# EAGLE board PCB (EAGLE 9.2.0)
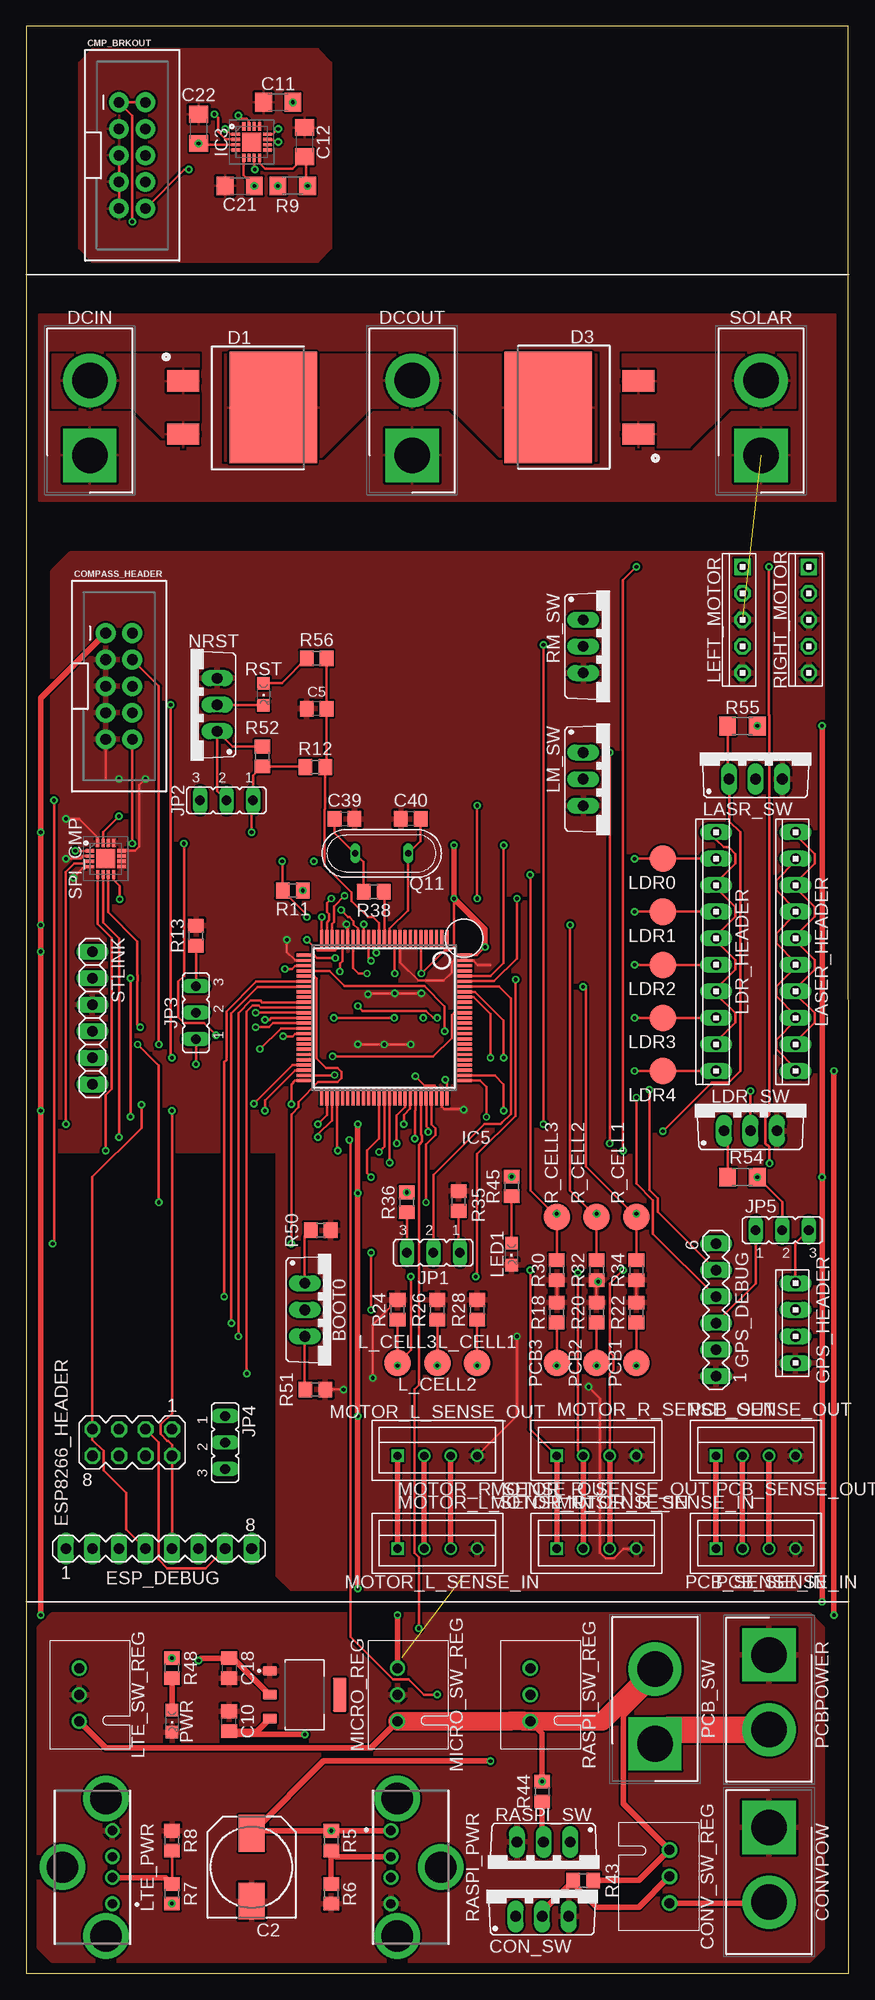
[diagram p5: board, top side]
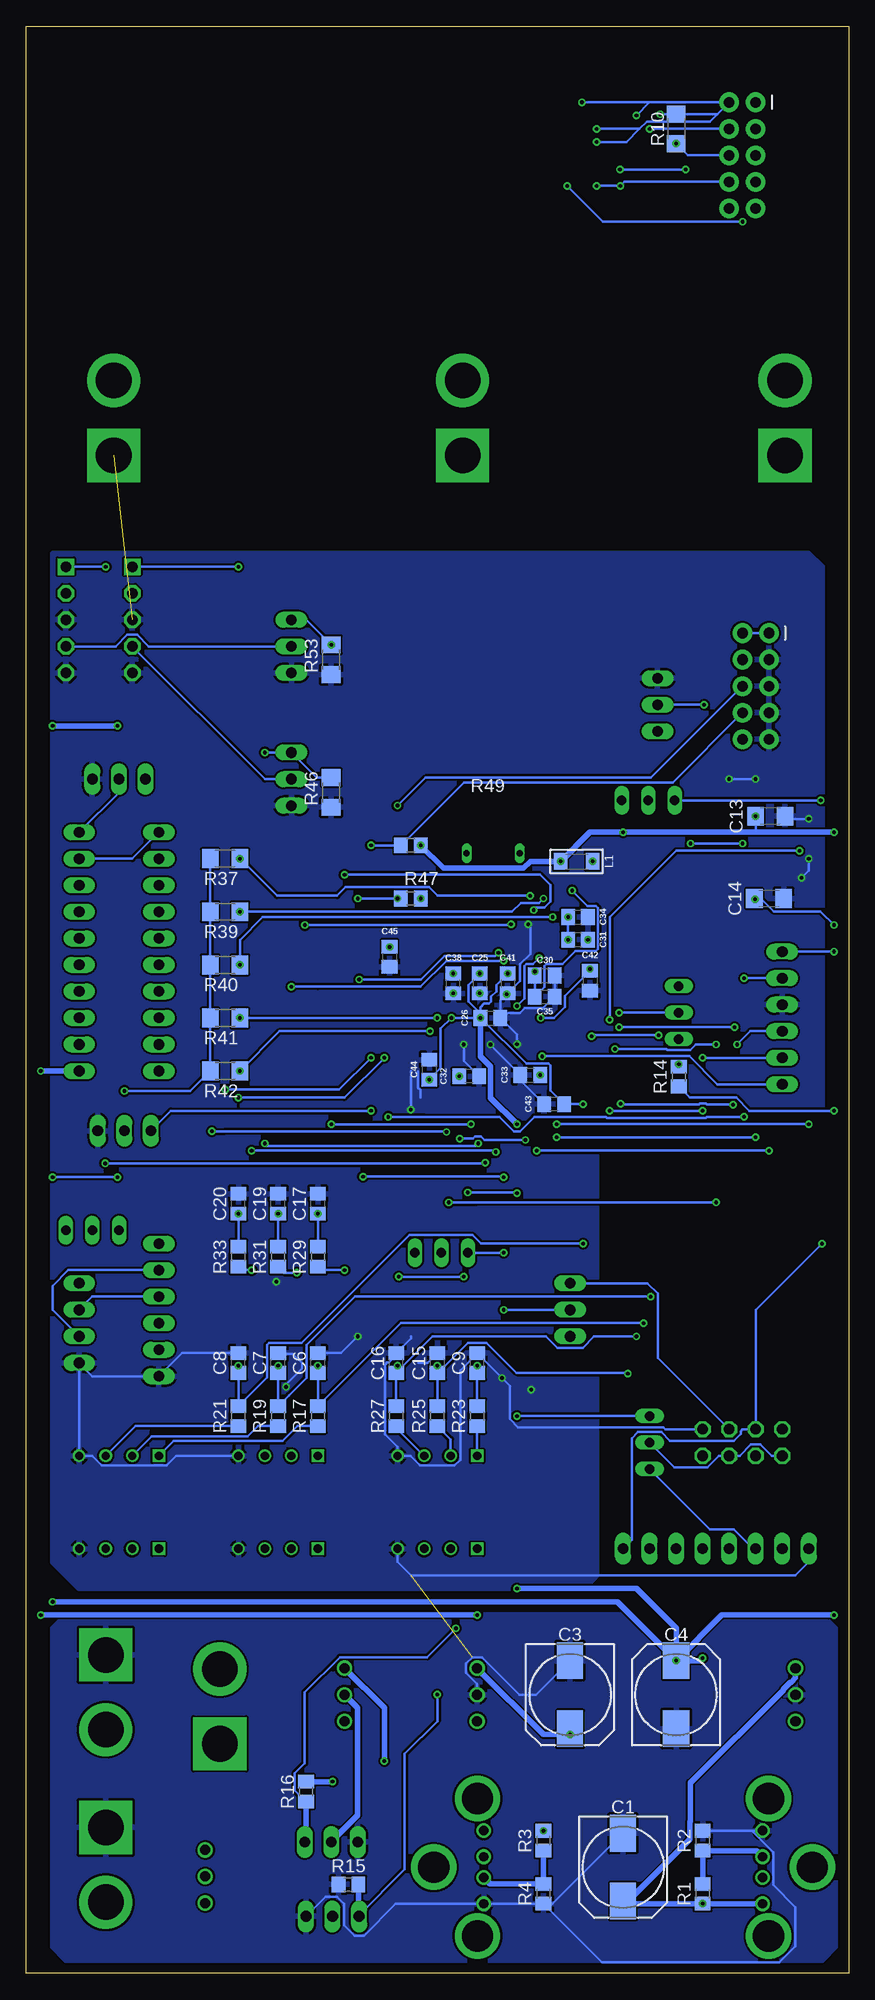
[diagram p6: board, bottom side, seen from below]

Size 78.74 x 186.36 mm. Coordinates in mm from the lower left corner, seen from the top.
Outline: 0,0 78.74,0 78.72,186.36 0,186.36 0,0
Copper layers (1*16): Top 0.0356mm / dielectric 1.5011mm / Bottom 0.0356mm
Design rules "ECE_Senior_Design *": minimum track width 8mil, minimum drill 13mil, track to track 8mil, track to pad 8mil, pad to pad 6mil, via to via 8mil, smd to smd 6mil, copper to edge 15mil, drill to drill 8mil, minimum pad ring 7mil, minimum via ring 7mil, stop-mask expansion 3mil, vias tented up to drill 0mil, thermal gap 10mil
Net classes: 0 default: width 0.254 mm

## Footprints (pad centres in the part's own frame; a part is rotated, then mirrored left to right if it is on the bottom)
TO220BV = drill 1.016 long: D 0,-2.54; G -2.54,-2.54; S 2.54,-2.54
140CLH-0810 = smd 3.5 x 2.5: + 3.25,0; - -3.25,0
C0805 = smd 1.3 x 1.5: 1 -0.95,0; 2 0.95,0
C1206 = smd 1.6 x 1.8: 1 -1.4,0; 2 1.4,0
2X5-SHROUDED = drill 1.016 pad 1.88: 1 -1.27,5.08; 2 1.27,5.08; 3 -1.27,2.54; 4 1.27,2.54; 5 -1.27,0; 6 1.27,0; 7 -1.27,-2.54; 8 1.27,-2.54; 9 -1.27,-5.08; 10 1.27,-5.08
OKI-78SR = drill 0.96 pad 1.46: 1 0,0; 2 2.54,0; 3 5.08,0
SHDR2W320P716_1X2_1574X813X158 = drill 3.4 pad 5.1 square: 1 0,0 | drill 3.4 pad 5.1: 2 7.163,0
TO-263AC(SMPD) = smd 2.03 x 3.05: 1 -2.54,-2.734; 2 2.54,-2.734 | smd 10.66 x 8.38: 3 0,5.881
MA04-2 = drill 1.016 octagon: 1 -3.81,-1.27; 2 -3.81,1.27; 3 -1.27,-1.27; 4 -1.27,1.27; 5 1.27,-1.27; 6 1.27,1.27; 7 3.81,-1.27; 8 3.81,1.27
MA08-1 = drill 1.016 long: 1 -8.89,0; 2 -6.35,0; 3 -3.81,0; 4 -1.27,0; 5 1.27,0; 6 3.81,0; 7 6.35,0; 8 8.89,0
MA06-1 = drill 1.016 long: 1 -6.35,0; 2 -3.81,0; 3 -1.27,0; 4 1.27,0; 5 3.81,0; 6 6.35,0
10X04MTA = drill 1.016 long: 1 3.81,0; 2 1.27,0; 3 -1.27,0; 4 -3.81,0
QFN50P300X300X100-17N = smd 0.8 x 0.3: 1 -1.5,0.75; 2 -1.5,0.25; 3 -1.5,-0.25; 4 -1.5,-0.75; 9 1.5,-0.75; 10 1.5,-0.25; 11 1.5,0.25; 12 1.5,0.75 | smd 0.3 x 0.8: 5 -0.75,-1.5; 6 -0.25,-1.5; 7 0.25,-1.5; 8 0.75,-1.5; 13 0.75,1.5; 14 0.25,1.5; 15 -0.25,1.5; 16 -0.75,1.5 | smd 1.8 x 1.8: 17 0,0
QFP50P1600X1600X160-100N = smd 0.3 x 1.6: 1 -6,-7.6; 2 -5.5,-7.6; 3 -5,-7.6; 4 -4.5,-7.6; 5 -4,-7.6; 6 -3.5,-7.6; 7 -3,-7.6; 8 -2.5,-7.6; 9 -2,-7.6; 10 -1.5,-7.6; 11 -1,-7.6; 12 -0.5,-7.6; 13 0,-7.6; 14 0.5,-7.6; 15 1,-7.6; 16 1.5,-7.6; 17 2,-7.6; 18 2.5,-7.6; 19 3,-7.6; 20 3.5,-7.6; 21 4,-7.6; 22 4.5,-7.6; 23 5,-7.6; 24 5.5,-7.6; 25 6,-7.6; 51 6,7.6; 52 5.5,7.6; 53 5,7.6; 54 4.5,7.6; 55 4,7.6; 56 3.5,7.6; 57 3,7.6; 58 2.5,7.6; 59 2,7.6; 60 1.5,7.6; 61 1,7.6; 62 0.5,7.6; 63 0,7.6; 64 -0.5,7.6; 65 -1,7.6; 66 -1.5,7.6; 67 -2,7.6; 68 -2.5,7.6; 69 -3,7.6; 70 -3.5,7.6; 71 -4,7.6; 72 -4.5,7.6; 73 -5,7.6; 74 -5.5,7.6; 75 -6,7.6 | smd 1.6 x 0.3: 26 7.6,-6; 27 7.6,-5.5; 28 7.6,-5; 29 7.6,-4.5; 30 7.6,-4; 31 7.6,-3.5; 32 7.6,-3; 33 7.6,-2.5; 34 7.6,-2; 35 7.6,-1.5; 36 7.6,-1; 37 7.6,-0.5; 38 7.6,0; 39 7.6,0.5; 40 7.6,1; 41 7.6,1.5; 42 7.6,2; 43 7.6,2.5; 44 7.6,3; 45 7.6,3.5; 46 7.6,4; 47 7.6,4.5; 48 7.6,5; 49 7.6,5.5; 50 7.6,6; 76 -7.6,6; 77 -7.6,5.5; 78 -7.6,5; 79 -7.6,4.5; 80 -7.6,4; 81 -7.6,3.5; 82 -7.6,3; 83 -7.6,2.5; 84 -7.6,2; 85 -7.6,1.5; 86 -7.6,1; 87 -7.6,0.5; 88 -7.6,0; 89 -7.6,-0.5; 90 -7.6,-1; 91 -7.6,-1.5; 92 -7.6,-2; 93 -7.6,-2.5; 94 -7.6,-3; 95 -7.6,-3.5; 96 -7.6,-4; 97 -7.6,-4.5; 98 -7.6,-5; 99 -7.6,-5.5; 100 -7.6,-6
JP2 = drill 0.914 long: 1 -2.54,0; 2 0,0; 3 2.54,0
L1206 = smd 1.3 x 1.6: 1 -1.524,0; 2 1.524,0
B2,54 = smd 2.54 x 2.54: TP 0,0
10X10MTA = drill 1.016 long: 1 11.43,0; 2 8.89,0; 3 6.35,0; 4 3.81,0; 5 1.27,0; 6 -1.27,0; 7 -3.81,0; 8 -6.35,0; 9 -8.89,0; 10 -11.43,0
CHIPLED_0805 = smd 1.2 x 1.2: A 0,-1.05; C 0,1.05
1X05MTA = drill 1.016 pad 1.575 square: 1 5.08,0 | drill 1.016 pad 1.575 octagon: 2 2.54,0; 3 0,0; 4 -2.54,0; 5 -5.08,0
105057-0001 = drill 0.9 pad 1.4: 1 -3.5,-1.9; 2 -1,-1.9; 3 1,-1.9; 4 3.5,-1.9 | drill 3 pad 4.35: 5 6.57,-1.3; 6 0,2.88; 7 -6.57,-1.3
SOT229P700X180-4N = smd 0.93 x 1.31: 1 -2.29,-3.345; 2 0,-3.345; 3 2.29,-3.345 | smd 3.24 x 1.31: 4 0,3.345
B4B-XH = drill 0.8 square: P$1 -3.81,0 | drill 0.8: P$2 -1.27,0; P$3 1.27,0; P$4 3.81,0
QS = drill 0.61 long: 1 -2.54,0; 2 2.54,0
R0805 = smd 1.3 x 1.5: 1 -0.95,0; 2 0.95,0
R1206 = smd 1.6 x 1.803: 1 -1.422,0; 2 1.422,0
1X06 = drill 1.016 long: 1 -6.35,0; 2 -3.81,0; 3 -1.27,0; 4 1.27,0; 5 3.81,0; 6 6.35,0

## Placement (x,y rotation side)
BOOT0  IRF512  [TO220BV]  29.21,63.5 270 top
C1  100uF  [140CLH-0810]  21.59,10.16 270 bottom
C2  100uF  [140CLH-0810]  21.59,10.16 90 top
C3  100uF  [140CLH-0810]  26.67,26.67 270 bottom
C4  100uF  [140CLH-0810]  16.51,26.67 90 bottom
C5  100nF  [C0805]  27.81,121.03 180 top
C6  22nF  [C0805]  50.8,58.42 90 bottom
C7  22nF  [C0805]  54.61,58.42 90 bottom
C8  22nF  [C0805]  58.42,58.42 90 bottom
C9  22nF  [C0805]  35.56,58.42 90 bottom
C10  10uF  [C0805]  19.43,24.13 90 top
C11  10uF  [C1206]  24.13,179.07 180 top
C12  10uF  [C1206]  26.67,175.26 90 top
C13  0.1uF  [C1206]  7.49,110.74 180 bottom
C14  0.1uF  [C1206]  7.62,102.87 0 bottom
C15  22nF  [C0805]  39.37,58.42 90 bottom
C16  22nF  [C0805]  43.31,58.42 90 bottom
C17  22nF  [C0805]  50.8,73.66 90 bottom
C18  22uF  [C0805]  19.43,29.21 270 top
C19  22nF  [C0805]  54.61,73.66 90 bottom
C20  22nF  [C0805]  58.42,73.66 90 bottom
C21  10pF  [C1206]  20.45,171.07 0 top
C22  10pF  [C1206]  16.51,176.53 270 top
C25  100nF  [C0805]  35.31,94.74 270 bottom
C26  10uF  [C0805]  34.29,91.44 0 bottom
C30  100nF  [C0805]  29.08,95.5 0 bottom
C31  100nF  [C0805]  25.91,98.93 0 bottom
C32  2.2uF  [C0805]  36.32,85.85 180 bottom
C33  2.2uF  [C0805]  30.48,85.98 0 bottom
C34  1uF  [C0805]  25.91,101.09 0 bottom
C35  1uF  [C0805]  29.08,93.47 0 bottom
C38  100nF  [C0805]  37.85,94.74 90 bottom
C39  20pF  [C0805]  30.48,110.49 0 top
C40  20pF  [C0805]  36.83,110.49 180 top
C41  100nF  [C0805]  32.64,94.74 270 bottom
C42  100nF  [C0805]  24.77,95 270 bottom
C43  100nF  [C0805]  28.19,83.19 180 bottom
C44  100nF  [C0805]  40.13,86.49 90 bottom
C45  100nF  [C0805]  43.94,97.28 270 bottom
CMP_BRKOUT  [2X5-SHROUDED]  10.16,173.99 0 top
COMPASS_HEADER  [2X5-SHROUDED]  8.89,123.19 0 top
CON_SW  IRF512  [TO220BV]  49.4,8 0 top
CONV_SW_REG  OKI-78SR-5_1.5-W36-C  [OKI-78SR]  61.59,11.81 270 top
CONVPOW  [SHDR2W320P716_1X2_1574X813X158]  71.12,13.97 270 top
D1  V60D45C-M3_I  [TO-263AC(SMPD)]  17.78,149.86 270 top
D3  V60D45C-M3_I  [TO-263AC(SMPD)]  55.88,149.86 90 top
DCIN  [SHDR2W320P716_1X2_1574X813X158]  6.1,145.29 90 top
DCOUT  [SHDR2W320P716_1X2_1574X813X158]  36.96,145.29 90 top
ESP8266_HEADER  [MA04-2]  10.16,50.8 180 top
ESP_DEBUG  [MA08-1]  12.7,40.64 0 top
GPS_DEBUG  [MA06-1]  66.04,63.5 90 top
GPS_HEADER  [10X04MTA]  73.66,62.23 90 top
IC3  MLX90393ELW-ABA-011-SP  [QFN50P300X300X100-17N]  21.59,175.26 0 top
IC5  STM32F407VGT6  [QFP50P1600X1600X160-100N]  34.29,91.44 180 top
JP1  [JP2]  38.99,68.96 180 top
JP2  [JP2]  19.18,112.27 180 top
JP3  [JP2]  16.26,91.95 90 top
JP4  [JP2]  19.05,50.8 270 top
JP5  [JP2]  72.39,71.12 0 top
L1  FB_1206  [L1206]  26.04,106.43 180 bottom
L_CELL1  TPSQB2,54  [B2,54]  43.18,58.42 0 top
L_CELL2  TPSQB2,54  [B2,54]  39.37,58.42 0 top
L_CELL3  PCB_CELL3  [B2,54]  35.56,58.42 0 top
LASER_HEADER  [10X10MTA]  73.66,97.79 90 top
LASR_SW  IRF512  [TO220BV]  69.85,116.84 0 top
LDR0  TPSQB2,54  [B2,54]  60.96,106.68 180 top
LDR1  TPSQB2,54  [B2,54]  60.96,101.6 180 top
LDR2  TPSQB2,54  [B2,54]  60.96,96.52 180 top
LDR3  TPSQB2,54  [B2,54]  60.96,91.44 180 top
LDR4  TPSQB2,54  [B2,54]  60.96,86.36 180 top
LDR_HEADER  [10X10MTA]  66.04,97.79 90 top
LDR_SW  IRF512  [TO220BV]  69.34,83.19 0 top
LED1  BLUE  [CHIPLED_0805]  46.48,68.83 180 top
LEFT_MOTOR  [1X05MTA]  68.58,129.54 90 top
LM_SW  IRF512  [TO220BV]  55.88,114.3 270 top
LTE_PWR  LTE Modem Power Supply  [105057-0001]  6.35,10.16 90 top
LTE_SW_REG  OKI-78SR-5_1.5-W36-C  [OKI-78SR]  5.08,24.13 90 top
MICRO_REG  AMS1117-3.3  [SOT229P700X180-4N]  26.67,26.67 270 top
MICRO_SW_REG  OKI-78SR-5_1.5-W36-C  [OKI-78SR]  35.56,24.13 90 top
MOTOR_L_SENSE_IN  MOTOR_L_SENSE_IN  [B4B-XH]  39.37,40.64 0 top
MOTOR_L_SENSE_OUT  MOTOR_R_SENSE_OUT  [B4B-XH]  39.37,49.53 0 top
MOTOR_R_SENSE_IN  MOTOR_R_SENSE_IN  [B4B-XH]  54.61,40.64 0 top
MOTOR_R_SENSE_OUT  MOTOR_R_SENSE_OUT  [B4B-XH]  54.61,49.53 0 top
NRST  IRF512  [TO220BV]  15.75,121.41 90 top
PCB1  TPSQB2,54  [B2,54]  58.42,58.42 0 top
PCB2  TPSQB2,54  [B2,54]  54.61,58.42 0 top
PCB3  PCB_CELL3  [B2,54]  50.8,58.42 0 top
PCB_SENSE_IN  PCB_SENSE_IN  [B4B-XH]  69.85,40.64 0 top
PCB_SENSE_OUT  PCB_SENSE_OUT  [B4B-XH]  69.85,49.53 0 top
PCB_SW  [SHDR2W320P716_1X2_1574X813X158]  60.2,21.97 90 top
PCBPOWER  [SHDR2W320P716_1X2_1574X813X158]  71.12,30.48 270 top
PWR  RED  [CHIPLED_0805]  13.97,24.13 180 top
Q11  8Mhz  [QS]  34.04,107.19 180 top
R1  43k  [R0805]  13.97,7.62 90 bottom
R2  51k  [R0805]  13.97,12.7 90 bottom
R3  43K  [R0805]  29.21,12.7 270 bottom
R4  51K  [R0805]  29.21,7.62 270 bottom
R5  75K  [R0805]  29.21,12.7 270 top
R6  51K  [R0805]  29.21,7.62 270 top
R7  75k  [R0805]  13.97,7.62 90 top
R8  51k  [R0805]  13.97,12.7 90 top
R9  10K  [R1206]  25.53,171.07 180 top
R10  10K  [R1206]  16.51,176.53 270 bottom
R11  47  [R0805]  25.53,103.63 180 top
R12  100K  [R0805]  27.69,115.44 0 top
R13  510  [R0805]  16.26,99.31 270 top
R14  10K  [R0805]  16.26,85.83 90 bottom
R15  100k  [R0805]  47.88,8.51 0 bottom
R16  10k  [R0805]  51.94,17.4 270 bottom
R17  18k  [R0805]  50.8,53.34 90 bottom
R18  6.2k  [R0805]  50.8,63.25 90 top
R19  8.2k  [R0805]  54.61,53.34 90 bottom
R20  5.1k  [R0805]  54.61,63.25 90 top
R21  680  [R0805]  58.42,53.34 90 bottom
R22  2.4k  [R0805]  58.42,63.25 90 top
R23  18k  [R0805]  35.56,53.34 90 bottom
R24  6.2k  [R0805]  35.56,63.5 90 top
R25  8.2k  [R0805]  39.37,53.34 90 bottom
R26  5.1k  [R0805]  39.37,63.5 90 top
R27  680  [R0805]  43.31,53.34 90 bottom
R28  2.4k  [R0805]  43.18,63.5 90 top
R29  18k  [R0805]  50.8,68.58 90 bottom
R30  6.2k  [R0805]  50.8,67.31 270 top
R31  8.2k  [R0805]  54.61,68.58 90 bottom
R32  5.1k  [R0805]  54.61,67.31 270 top
R33  680  [R0805]  58.42,68.58 90 bottom
R34  2.4k  [R0805]  58.42,67.31 270 top
R35  510  [R0805]  41.4,73.91 270 top
R36  10K  [R0805]  36.45,73.79 90 top
R37  100k  [R1206]  59.69,106.68 180 bottom
R38  220  [R0805]  33.27,103.5 180 top
R39  100k  [R1206]  59.69,101.6 180 bottom
R40  100k  [R1206]  59.69,96.52 180 bottom
R41  100k  [R1206]  59.69,91.44 180 bottom
R42  100k  [R1206]  59.69,86.36 180 bottom
R43  1M  [R0805]  53.34,8.89 180 top
R44  1M  [R0805]  49.4,17.4 270 top
R45  200  [R0805]  46.48,75.31 270 top
R46  100k  [R1206]  49.53,113.03 90 bottom
R47  10K  [R0805]  41.91,102.87 0 bottom
R48  200  [R0805]  13.97,29.21 270 top
R49  10K  [R0805]  41.91,107.95 0 bottom
R50  100K  [R0805]  28.19,71.12 180 top
R51  510  [R0805]  27.69,55.88 0 top
R52  100K  [R0805]  22.61,116.46 90 top
R53  100k  [R1206]  49.53,125.73 90 bottom
R54  100k  [R1206]  68.58,76.2 0 top
R55  100k  [R1206]  68.58,119.38 0 top
R56  200  [R0805]  27.81,125.86 0 top
R_CELL1  TPSQB2,54  [B2,54]  58.42,72.39 0 top
R_CELL2  TPSQB2,54  [B2,54]  54.61,72.39 0 top
R_CELL3  PCB_CELL3  [B2,54]  50.8,72.39 0 top
RASPI_PWR  Raspi Power Supply  [105057-0001]  36.83,10.16 270 top
RASPI_SW  IRF512  [TO220BV]  49.53,10.03 180 top
RASPI_SW_REG  OKI-78SR-5_1.5-W36-C  [OKI-78SR]  48.26,24.13 90 top
RIGHT_MOTOR  [1X05MTA]  74.93,129.54 90 top
RM_SW  IRF512  [TO220BV]  55.88,127 270 top
RST  RED  [CHIPLED_0805]  22.73,122.43 180 top
SOLAR  [SHDR2W320P716_1X2_1574X813X158]  70.36,145.29 90 top
SPI_CMP  MLX90393ELW-ABA-011-SP  [QFN50P300X300X100-17N]  7.62,106.68 0 top
STLINK  [1X06]  6.35,91.44 270 top

## Tracks (layer width: path | path; a pad name or v marks a point on that pad's centre or on a via)
C_MOS  (via drill 0.35)
  Top 0.254: v30.94,79.76 31.07,79.63 31.07,32.2 35.12,28.15 36.62,28.15 38.1,26.67 v39.37,26.67 | IC5.69 37.27,83.82 37.27,82.61 37.21,82.55 v37.21,79.88
  Bottom 0.254: v37.21,79.88 35.98,79.88 35.76,80.11 35.19,80.11 34.84,79.76 v30.94,79.76 | v39.37,26.67 39.37,24.13 42.5,21 42.5,9.96 46.93,5.53
  Bottom 0.508: R15.2 46.93,5.53 CON_SW.G
CMP_INT  (via drill 0.35)
  Top 0.254: v12.7,88.9 12.7,123.19 COMPASS_HEADER.4 | v22.38,88.47 22.42,88.47 24.39,90.44 IC5.40
  Bottom 0.254: v22.38,88.47 17.44,88.47 17.36,88.39 15.15,88.39 14.64,88.9 v12.7,88.9
CMP_MISO  (via drill 0.35)
  Top 0.254: SPI_CMP.6 7.37,100.58 8.89,99.06 v8.89,80.01 | IC5.53 29.27,83.82 29.27,81.64 27.94,80.31 v27.94,80.01
  Bottom 0.254: v27.94,80.01 v8.89,80.01
CMP_MOSI  (via drill 0.35)
  Top 0.254: IC5.54 29.79,78.8 v29.84,78.74 | v7.62,78.74 7.62,84.05 8.2,84.64 8.2,99.1 6.87,100.43 SPI_CMP.5
  Bottom 0.254: v29.84,78.74 v7.62,78.74
CMP_SCL  (via drill 0.35)
  Top 0.254: IC5.95 41.91,94.96 44.81,94.96 46.99,97.14 v46.99,102.87 | v43.18,111.76 v43.18,102.87
  Bottom 0.254: COMPASS_HEADER.6 18.92,114.43 35.56,114.43 40.51,114.43 v43.18,111.76 | R47.1 v43.18,102.87 v46.99,102.87
CMP_SCLK  (via drill 0.35)
  Top 0.254: IC5.52 28.79,82.13 v27.94,81.28 | SPI_CMP.3 5.6,106.43 5.4,106.22 4.62,106.22 3.81,105.41 v3.81,81.28
  Bottom 0.254: v3.81,81.28 v27.94,81.28
CMP_SDA  (via drill 0.35)
  Top 0.254: IC5.96 44.45,95.44 45.72,96.71 v45.72,107.95
  Bottom 0.254: v45.72,107.95 R49.1 36.84,113.97 16.84,113.97 COMPASS_HEADER.8
CMP_SPI_INT  (via drill 0.35)
  Top 0.254: SPI_CMP.1 4.71,107.43 v4.7,107.44 | IC5.38 26.67,91.42 23.46,91.42 23.3,91.26 v22.86,91.26
  Bottom 0.254: v4.7,107.44 16.51,107.44 22.85,101.1 v22.85,91.27 v22.86,91.26
CMP_TRG  (via drill 0.35)
  Top 0.254: v24.6,89.69 25.52,89.69 25.75,89.92 26.67,89.92 IC5.41 | v10.16,108.12 COMPASS_HEADER.10 | v18.18,89.79 17.04,90.93 15.15,90.93 14.55,91.53 14.55,94.91 15.11,95.47 v15.11,108.12
  Bottom 0.254: v15.11,108.12 v10.16,108.12 | v18.18,89.79 24.5,89.79 v24.6,89.69
CMP_TRIG  (via drill 0.35)
  Top 0.254: SPI_CMP.7 7.87,101.55 10.65,98.77 10.65,95.56 10.68,95.53 10.68,94.97 10.65,94.94 10.65,90.82 v10.92,90.55 | v21.97,90.55 23.24,90.55 23.63,90.94 IC5.39
  Bottom 0.254: v21.97,90.55 v10.92,90.55
ESP_GPIO0  (via drill 0.35)
  Top 0.254: v2.67,112.27 2.67,69.98 v2.54,69.85
  Bottom 0.254: v2.67,112.27 JP2.3 | ESP_DEBUG.8 20.75,41.48 20.75,51.22 20.16,51.82 17.94,51.82 17.11,50.98 10.98,50.98 10.34,51.62 10.34,51.89 10.16,52.07 ESP8266_HEADER.5 8.89,63.5 v2.54,69.85
ESP_GPIO2
  Top 0.254: ESP8266_HEADER.3 12.7,50.8 12.7,39.6 13.52,38.79 17.2,38.79 ESP_DEBUG.7 | BOOT0.G 26.67,70.55 R50.2
  Bottom 0.254: ESP8266_HEADER.3 18.27,58.91 18.27,65.05 19.26,66.04 BOOT0.G
ESP_RX  (via drill 0.35)
  Top 0.254: ESP_DEBUG.4 9.57,42.5 9.57,46 7.44,48.13 7.44,49.98 6.35,51.08 ESP8266_HEADER.7 6.35,76.2 11.05,80.9 v11.05,83.14 | IC5.47 26.67,86.92 25.5,86.92 v21.81,83.23
  Bottom 0.254: v21.81,83.23 21.71,83.14 14.35,83.14 14.25,83.23 13.69,83.23 13.59,83.14 v11.05,83.14
ESP_TX  (via drill 0.35)
  Top 0.254: ESP_DEBUG.5 ESP8266_HEADER.2 13.97,50.6 13.59,50.98 13.52,50.98 12.88,51.62 12.88,52.52 13.97,53.62 v13.97,82.55 | IC5.48 26.67,86.42 25.75,86.42 22.86,83.53 v22.86,82.55
  Bottom 0.254: v22.86,82.55 v13.97,82.55
GND  (via drill 0.35)  (2 unrouted)
  Top 0.254: v36.83,88.9 v34.29,88.9 v31.75,88.9 v31.74,88.91 | v32.74,93.69 32.83,93.79 C25.2 C38.1 | IC5.27 26.67,96.96 25.75,96.96 24.96,97.75 C31.2 | IC5.20 30.77,99.06 30.77,99.98 30.67,100.08 v30.67,100.4 | IC5.10 35.81,99.02 35.81,96.76 37.56,95.01 39.96,95.01 40.76,95.81 40.76,96.73 40.95,96.92 41.87,96.92 IC5.99 41.91,96.92 42.83,96.92 43.23,96.52 44.45,96.52 | R24.2 33.18,62.07 v33.18,56.99 | R51.2 v30.38,55.88 | MOTOR_R_SENSE_IN.P$4 57.2,40.64 56.27,39.71 55.49,39.71 54.95,40.26 54.95,55.03 v53.85,56.13 | v11.43,114.3 10.84,113.71 10.84,107.84 10.44,107.44 9.13,107.44 SPI_CMP.12 | COMPASS_HEADER.9 7.62,114.3 | 6.1,106.91 SPI_CMP.2 6.1,106.91 | 6.1,106.91 5.44,106.91 | IC5.74 39.81,83.82 | IC5.74 39.77,83.82 | IC5.74 39.81,83.82 | 39.81,83.82 39.81,82.9 40,82.71 41.85,82.71 v41.91,82.65 | SPI_CMP.16 6.87,108.7 5.08,110.49 v3.81,110.49 | v3.81,106.68 5.21,106.68 5.44,106.91 | 6.1,106.91 5.44,106.91 | MOTOR_L_SENSE_OUT.P$4 46.99,53.34 v46.99,60.96 | R30.2 R18.2 | R20.2 R32.2 v54.77,66.2 54.93,66.04 | R34.2 R22.2 | SPI_CMP.4 5.75,105.93 5.58,105.77 5.44,105.77 v4.52,104.85
  Bottom 0.254: C30.2 27.94,95.5 28.13,95.31 C35.2 28.17,93.47 29.25,92.39 30.98,92.39 31.47,91.9 32.56,91.9 33.18,91.28 | 40.13,87.33 C44.2 40.13,87.4 40.27,87.26 | 41.21,86.32 41.21,84.75 41,84.53 41,83.82 | R53.1 49.68,124.46 | MOTOR_L_SENSE_IN.P$4 43.18,39.37 41.91,38.1 5.08,38.1 3.81,39.37 ESP_DEBUG.1 | MOTOR_R_SENSE_OUT.P$4 64.37,49.53 65.3,48.6 71.5,48.6 72.44,49.53 PCB_SENSE_OUT.P$4 GPS_HEADER.4 72.39,57.15 GPS_DEBUG.1 63.82,59.37 C8.2 58.1,59.69 | 41.91,60.96 41.91,60.77 C16.2 43.18,59.24 43.97,58.45 44.19,58.45 44.39,58.26 44.39,51.6 43.18,50.4 MOTOR_L_SENSE_OUT.P$4 41.96,49.53 41.02,48.6 37.72,48.6 37.17,49.15 37.17,57.73 35.56,59.34 C9.2 v33.18,56.99 32.43,56.24 32.43,53.06 31.65,52.27 17.75,52.27 17.55,52.07 ESP8266_HEADER.1 | 41.2,58.42 40.32,58.42 C15.2 | C3.- 29.92,26.67 31.52,26.67 35.12,30.27 36,30.27 36.62,29.65 36.62,28.77 35.56,27.71 MICRO_SW_REG.2 | C1.- 28.33,6.67 R6.2 | LTE_PWR.4 R8.2 9.28,13.65 7.22,11.59 7.22,8.49 5.08,6.35 5.08,2.62 6.61,1.08 23.62,1.08 R6.2 | R6.2 RASPI_PWR.4 43.36,6.66 46.41,3.61 47.31,3.61 48.31,4.6 48.31,6.67 48.95,7.32 50.09,7.32 CON_SW.S | C32.1 36.83,87.31 v36.83,88.9 | v31.74,88.91 v31.75,88.9 31.75,89.85 33.18,91.28 | 33.18,91.28 C26.2 33.34,93.09 v32.74,93.69 | C43.2 31.43,85.47 C33.1 34.29,88.84 v34.29,88.9 | C41.2 v32.74,93.69 | C42.2 24.77,94.08 | v30.67,100.4 30.55,100.4 30.48,100.33 30.48,97.57 31.47,96.58 31.47,94.96 v32.74,93.69 | C13.1 6.09,110.49 v3.81,110.49 | v30.38,55.88 30.48,55.88 | v8.89,114.3 v11.43,114.3 | v41.91,82.65 41.91,86.36 | v46.99,60.96 48.58,59.37 C6.2 | C7.2 54.55,59.31 53.23,59.31 52.34,58.42 52.34,57.88 53.85,56.37 v53.85,56.13
  Bottom 0.254: v4.52,104.85 3.81,105.56 v3.81,106.68
  other vias: 24.96,98.93 35.31,93.79 37.85,93.79
  pour Top: 1.27,2.54 2.54,1.27 74.93,1.27 76.2,2.54 76.2,33.02 74.93,34.29 2.54,34.29 1.27,33.02
  pour Top: 76.2,39.37 73.66,36.83 25.4,36.83 24.13,38.1 24.13,78.74 2.54,78.74 2.54,134.11 4.32,135.89 76.2,135.89
  pour Bottom: 76.2,2.54 74.93,1.27 2.54,1.27 1.27,2.54 1.27,33.02 2.54,34.29 74.93,34.29 76.2,33.02
  pour Top (rank 3): 1.27,158.75 1.27,140.97 77.47,140.97 77.47,158.75
  pour Bottom: 3.81,135.89 2.54,134.62 2.54,78.74 24.13,78.74 24.13,38.1 25.4,36.83 73.66,36.83 76.2,39.37 76.2,135.89
GND_BREAKOUT
  Top 0.254: CMP_BRKOUT.5 CMP_BRKOUT.7 CMP_BRKOUT.9
  pour Top: 6.35,163.83 27.94,163.83 29.21,165.1 29.21,182.88 27.94,184.15 6.35,184.15 5.08,182.88 5.08,165.1
GPS_RX  (via drill 0.35)
  Top 0.254: v58.42,83.82 58.42,75.58 60.02,73.98 60.02,70.79 GPS_DEBUG.4 | IC5.92 41.91,93.42 42.83,93.42 44.45,91.8 v44.45,87.63
  Bottom 0.254: GPS_DEBUG.4 72.39,64.77 GPS_HEADER.2 | v44.45,87.63 48.26,83.82 v58.42,83.82
GPS_TX  (via drill 0.35)
  Top 0.254: GPS_DEBUG.5 60.48,72.87 60.48,74.17 59.67,74.97 v59.67,84.58 | IC5.93 41.91,93.92 42.97,93.92 45.72,91.17 v45.72,87.63
  Bottom 0.254: GPS_HEADER.3 76.2,63.5 76.2,65.81 74.7,67.31 GPS_DEBUG.5 | v45.72,87.63 48.77,84.58 v59.67,84.58
L_MOS  (via drill 0.35)
  Top 0.254: IC5.67 36.27,83.82 36.27,82.9 35.47,82.11 v35.47,79.42 | v55.88,79.42 v55.88,116.84
  Bottom 0.254: R46.2 50.95,114.45 LM_SW.G v55.88,116.84 | v35.47,79.42 35.7,79.2 55.88,79.2 v55.88,79.42
L_PWM  (via drill 0.35)
  Top 0.254: v58.42,134.62 57.15,133.35 v57.15,78.74 | 34.29,79.12 34.1,78.93 | 34.1,78.93 v33.78,78.61 | IC5.63 34.29,79.12 | 34.29,79.12 34.1,78.93
  Bottom 0.254: LEFT_MOTOR.1 v58.42,134.62 | v57.15,78.74 55.88,78.74 33.91,78.74 v33.78,78.61
LASER_MOS  (via drill 0.35)
  Top 0.254: R55.1 67.16,114.45 LASR_SW.G 67.31,110.26 68.35,109.22 68.35,86.36 67.25,85.27 65.63,85.27 v60.96,80.6 | IC5.71 38.31,83.82 38.31,81.07 38.5,80.88 v38.5,80.53
  Bottom 0.254: v38.5,80.53 38.57,80.6 59.69,80.6 v60.96,80.6
LDR0  (via drill 0.35)
  Top 0.254: LDR_HEADER.2 LDR0.TP R37.1 | IC5.23 29.29,100.45 29.46,100.62 29.46,101.6 29.46,102.12 v30.48,103.14
  Bottom 0.254: R37.1 54.73,103.14 48.95,103.14 48.15,103.95 40.17,103.95 39.36,103.14 v30.48,103.14
  other vias: 58.27,106.68
LDR1  (via drill 0.35)
  Top 0.254: LDR_HEADER.4 LDR1.TP R39.1 | v29.21,102.87 28.79,102.45 28.79,101.59 29,101.38 29,100.81 28.79,100.59 IC5.24
  Bottom 0.254: R39.1 32.21,101.6 31.35,102.46 29.62,102.46 v29.21,102.87
  other vias: 58.27,101.6
LDR2  (via drill 0.35)
  Top 0.254: LDR_HEADER.6 LDR2.TP R40.1 | IC5.25 28.29,101.06 v28.32,101.09
  Bottom 0.254: R40.1 58.27,98.91 56.1,101.08 28.33,101.08 v28.32,101.09
  other vias: 58.27,96.52
LDR3  (via drill 0.35)
  Top 0.254: LDR_HEADER.8 LDR3.TP R41.1 | IC5.26 26.71,97.42 27.63,97.42 27.88,97.17 v29.61,97.17 | v31.75,92.59 32.21,92.12 38.3,92.12 38.98,91.44 v39.37,91.44
  Bottom 0.254: R41.1 v39.37,91.44 | v29.61,97.17 30.2,96.58 30.82,96.58 31.01,96.39 31.01,93.32 v31.75,92.59
  other vias: 58.27,91.44
LDR4  (via drill 0.35)
  Top 0.254: R42.1 LDR4.TP LDR_HEADER.10 | IC5.29 26.71,95.92 29.03,95.92 30.48,94.47 38.13,94.47 40.08,92.53 v40.08,90.17
  Bottom 0.254: R42.1 54.46,90.17 v40.08,90.17
  other vias: 58.27,86.36
LDR_MOS  (via drill 0.35)
  Top 0.254: R54.1 67.16,80.29 LDR_SW.G | IC5.77 44.87,85.94 45.72,85.09 v45.72,82.55
  Bottom 0.254: LDR_SW.G 64.9,82.55 v45.72,82.55
MOTOR_L_CELL1  (via drill 0.35)
  Top 0.254: R28.1 L_CELL1.TP v43.18,58.16 | v20.32,60.96 20.32,91.91 21.5,93.09 22.44,93.09 22.59,92.94 IC5.35
  Bottom 0.254: R27.2 C16.1 | C16.1 43.18,57.6 v43.18,58.16 | C16.1 39.82,60.96 28.98,60.96 27.88,59.87 25.46,59.87 24.36,60.96 v20.32,60.96
MOTOR_L_CELL2  (via drill 0.35)
  Top 0.254: L_CELL2.TP R26.1 | 22.25,92.63 21.69,92.63 | 22.45,92.44 IC5.36 22.45,92.44 | 22.45,92.44 22.25,92.63 | 21.69,92.63 21.13,92.07 | 21.69,92.63 22.25,92.63 | 22.25,92.63 22.45,92.44 | 21.13,92.07 21.69,92.63 | 21.13,92.07 v21.13,57.4 | L_CELL2.TP v39.37,58.16 L_CELL2.TP
  Bottom 0.254: R25.2 C15.1 | 36.45,60.35 34.67,60.35 | C15.1 39.33,57.47 | 39.33,57.47 36.45,60.35 | 34.67,60.35 31.79,57.47 | v21.13,57.4 21.19,57.47 31.79,57.47 | 36.45,60.35 34.67,60.35 | C15.1 39.33,57.47 | 39.33,57.47 36.45,60.35 | 34.67,60.35 31.79,57.47 | C15.1 v39.37,58.16
MOTOR_L_CELL3  (via drill 0.35)
  Top 0.254: L_CELL3.TP R24.1 | v46.86,95.12 46.86,82.55 46.86,82.08 43.18,78.4 43.18,66.8 v43.05,66.67 | L_CELL3.TP 36.83,59.69 v36.83,66.67 | IC5.15 33.29,97.91 v33.52,97.68 | v35.56,58.16 L_CELL3.TP
  Bottom 0.254: R23.2 35.56,57.15 C9.1 v35.56,58.16 | v43.05,66.67 v36.83,66.67 | v33.52,97.68 33.85,97.36 38.7,97.36 40.93,95.12 v46.86,95.12
MOTOR_R_CELL1  (via drill 0.35)
  Top 0.254: IC5.16 32.79,97.13 v33.02,96.9 | v53.34,94.44 53.57,94.21 53.57,77.24 R_CELL1.TP | R34.1 R_CELL1.TP | C20.1 R_CELL1.TP
  Bottom 0.254: v53.34,94.44 50.8,94.44 40.97,94.44 38.51,96.9 v33.02,96.9 | R33.2 C20.1
  other vias: 58.42,72.71
MOTOR_R_CELL2  (via drill 0.35)
  Top 0.254: R_CELL2.TP 54.61,71.44 R32.1 | IC5.17 32.29,100.37 v32.32,100.4 | v52.07,100.33 52.07,74.93 R_CELL2.TP | C19.1 R_CELL2.TP
  Bottom 0.254: R31.2 C19.1 | v32.32,100.4 32.38,100.33 v52.07,100.33
  other vias: 54.61,72.71
MOTOR_R_CELL3  (via drill 0.35)
  Top 0.254: R_CELL3.TP R30.1 | R_CELL3.TP 48.26,74.93 v48.26,105.16 | IC5.18 31.77,99.06 31.77,99.98 31.35,100.39 31.35,100.68 30.95,101.08 30.84,101.08 v30.16,101.76 | C17.1 R_CELL3.TP
  Bottom 0.254: v30.16,101.76 29.92,102 29.11,102 28.53,102.59 28.53,104.14 29.57,105.18 48.23,105.18 v48.26,105.16 | R29.2 C17.1
  other vias: 50.8,72.71
N$1
  Top 0.508: PCB_SENSE_OUT.P$3 PCB_SENSE_IN.P$3
  Bottom 0.254: R21.1 68.26,52.39 PCB_SENSE_OUT.P$3
N$2
  Top 0.508: CONV_SW_REG.3 71.04,6.73 CONVPOW.2
N$3  (via drill 0.35)
  Top 0.254: IC5.37 v21.98,91.94 v21.97,91.95
  Bottom 0.254: v21.97,91.95 JP3.2
N$4
  pour Top (rank 2): 16.51,153.67 16.51,146.05 13.97,146.05 10.16,149.86 3.81,149.86 2.54,149.86 2.54,154.94 16.51,154.94
N$5
  pour Top: 57.15,153.67 57.15,146.05 59.69,146.05 63.5,146.05 67.31,149.86 73.66,149.86 73.66,154.94 57.15,154.94
N$6  (via drill 0.35)
  Bottom 0.508: C1.+ 21.35,6.67 | 21.35,6.67 R7.1 LTE_PWR.1 | LTE_SW_REG.3 5.08,28.28 5.5,27.86 5.57,27.86 6.27,27.16 6.27,27.09 15.13,18.24 15.13,14.54 15.18,14.49 15.18,12.84 21.35,6.67
  other vias: 13.97,6.67
N$7
  Bottom 0.508: R1.2 R2.1 8.84,11.75 LTE_PWR.3
N$8
  Top 0.508: PCB_SENSE_OUT.P$1 PCB_SENSE_IN.P$1
  Bottom 0.254: PCB_SENSE_OUT.P$1 64.62,50.95 54.18,50.95 52.74,52.39 R17.1
N$9
  Top 0.254: R8.1 R7.2
  Top 0.508: LTE_PWR.2 13.38,9.16 R7.2
N$10
  Top 0.508: MOTOR_L_SENSE_OUT.P$3 MOTOR_L_SENSE_IN.P$3
  Bottom 0.254: MOTOR_L_SENSE_OUT.P$3 43.31,52.2 R27.1
N$11
  Top 0.508: R43.2 52.23,8.73 | 52.23,8.73 49.4,5.9 CON_SW.D | CONV_SW_REG.2 58.67,6.35 54.61,6.35 52.23,8.73
N$12
  Top 0.508: MOTOR_L_SENSE_OUT.P$2 MOTOR_L_SENSE_IN.P$2
  Bottom 0.254: MOTOR_L_SENSE_OUT.P$2 38.1,51.12 R25.1
N$13
  Top 0.508: RASPI_PWR.2 29.8,11.16 arc-90 R5.2 R6.1
N$14
  Top 0.508: MOTOR_L_SENSE_IN.P$1 MOTOR_L_SENSE_OUT.P$1
  Bottom 0.254: MOTOR_L_SENSE_OUT.P$1 R23.1
N$15
  Bottom 0.508: R3.2 R4.1 34.34,8.57 RASPI_PWR.3
N$16  (via drill 0.35)
  Top 0.508: C2.+ arc-90 21.83,13.65 | 21.83,13.65 R5.1 arc-90 R5.1 RASPI_PWR.1 | v44.45,20.32 28.5,20.32 21.83,13.65
  Bottom 0.508: RASPI_SW_REG.3 44.45,25.4 v44.45,20.32
  other vias: 29.21,13.65
N$17  (via drill 0.35)
  Top 0.254: v57.15,67.31 55.88,66.04 55.88,59.41 56.21,59.08 56.21,57.76 55.88,57.43 MOTOR_R_SENSE_OUT.P$3
  Top 0.508: MOTOR_R_SENSE_OUT.P$3 MOTOR_R_SENSE_IN.P$3
  Bottom 0.254: R33.1 58.1,67.31 v57.15,67.31
N$19
  Top 0.508: R44.2 49.4,12.7 RASPI_SW.D
  Bottom 0.508: RASPI_SW_REG.2 46.99,25.4 46.99,15.11 RASPI_SW.D
N$20  (via drill 0.35)
  Top 0.254: v52.83,67.06 52.83,50.04 MOTOR_R_SENSE_OUT.P$2
  Top 0.508: MOTOR_R_SENSE_OUT.P$2 MOTOR_R_SENSE_IN.P$2
  Bottom 0.254: R31.1 54.04,67.06 v52.83,67.06
N$22  (via drill 0.35)
  Top 0.254: IC3.1 19.57,176.01 v19.05,176.53
  Bottom 0.254: v19.05,176.53 CMP_BRKOUT.4
N$23  (via drill 0.35)
  Top 0.254: IC5.73 39.27,83.86 39.27,84.78 39.08,84.97 38.15,84.97 C32.2
  other vias: 37.27,85.85
N$24  (via drill 0.35)
  Top 0.254: IC3.3 16.63,175.01 C22.2
  Bottom 0.254: CMP_BRKOUT.6 15.39,173.99 R10.2 C22.2
  other vias: 16.51,175.13
N$25  (via drill 0.35)
  Top 0.254: C21.2 20.84,172.08 IC3.5
  Bottom 0.254: R9.2 C21.2 21.47,171.45 CMP_BRKOUT.8
  other vias: 21.85,171.07 24.11,171.07
N$26
  Bottom 0.254: LM_SW.D 55.88,114.3 LEFT_MOTOR.4
N$27
  Top 0.508: PCB_SENSE_OUT.P$2 PCB_SENSE_IN.P$2
  Bottom 0.254: R19.1 56.55,52.39 57.53,51.41 66.7,51.41 PCB_SENSE_OUT.P$2
N$28  (via drill 0.35)
  Top 0.254: v48.26,67.31 48.26,52.07 MOTOR_R_SENSE_OUT.P$1
  Top 0.508: MOTOR_R_SENSE_OUT.P$1 MOTOR_R_SENSE_IN.P$1
  Bottom 0.254: R29.1 50.48,67.31 v48.26,67.31
N$29  (via drill 0.35)
  Top 0.254: IC3.7 21.84,172.68 v21.89,172.63 | CMP_BRKOUT.10 15.15,172.63 v15.59,172.63
  Bottom 0.254: v21.89,172.63 v15.59,172.63
N$34
  Top 0.254: R56.1 24.48,123.48 RST.A
N$35
  pour Top: 54.61,154.94 54.61,144.78 45.72,144.78 40.64,149.86 35.56,149.86 34.29,149.86 34.29,154.94
  pour Top: 19.05,154.94 39.37,154.94 39.37,149.86 33.02,149.86 27.94,144.78 19.05,144.78
N$36  (via drill 0.35)
  Top 0.254: IC5.49 29.49,85.94 C33.2
  other vias: 29.53,85.98
N$37
  Top 0.508: R48.2 PWR.A
N$38  (via drill 0.35)
  Top 0.254: v16.26,87.02 JP3.1
  Bottom 0.254: R14.2 v16.26,87.02
N$39  (via drill 0.35)
  Top 0.254: v30.03,95.89 30.03,96.63 30.29,96.89 IC5.21
  Bottom 0.254: 23.98,101.98 23.98,101.6 | 23.98,101.6 23.98,98.05 24.17,97.85 26.14,97.85 27.41,96.58 28.92,96.58 29.11,96.39 29.11,94.39 C35.1 C30.1 v30.03,95.89 | 23.98,101.98 23.98,101.6 | R11.1 25.02,102.17 24.17,102.17 23.98,101.98
  other vias: 26.48,103.63
N$40  (via drill 0.35)
  Top 0.254: C34.1 26.86,101.35 R11.2 24.58,106.36 L1.1 | IC5.22 29.77,99.02 29.77,98.1 29.58,97.91 27.88,97.91 C31.1
  Bottom 0.254: C34.1 C31.1
  other vias: 26.86,98.93 26.86,101.09 24.51,106.43
N$41
  Bottom 0.254: ESP_DEBUG.3 9.12,40.64 10.98,42.49 13.28,42.49 JP4.3
N$43  (via drill 0.35)
  Top 0.254: IC5.62 33.79,79.89 32.64,78.74 32.64,76.58 v33.02,76.2
  Bottom 0.254: v33.02,76.2 33.08,76.26 R45.1
  other vias: 46.48,76.26
N$44
  Top 0.254: R52.2 19.75,117.41 NRST.G 18.29,113.16 JP2.2
N$45
  Top 0.254: BOOT0.S 26.67,55.95 R51.1
N$46
  Top 0.254: GPS_DEBUG.3 69.85,66.04 JP5.1
N$47  (via drill 0.35)
  Top 0.254: LDR_SW.D v69.34,84.45
  Bottom 0.254: R37.2 R39.2 R40.2 R41.2 R42.2 63.02,84.45 v69.34,84.45
N$48
  Bottom 0.254: ESP8266_HEADER.8 7.34,49.53 8.44,50.62 9.34,50.62 10.44,49.53 ESP8266_HEADER.4 12.43,49.53 13.52,48.44 16.69,48.44 JP4.2
N$49
  Top 0.254: GPS_HEADER.1 73.66,69.85 JP5.3
N$50
  Top 0.254: R45.2 LED1.A
N$51
  Top 0.254: LASER_HEADER.1 73.66,108.99 75.51,107.13 75.51,106.23 73.66,104.37 LASER_HEADER.3 73.66,103.91 75.51,102.05 75.51,101.15 73.66,99.29 LASER_HEADER.5 73.66,98.83 75.51,96.97 75.51,96.07 73.66,94.21 LASER_HEADER.7 73.66,93.75 75.51,91.89 75.51,90.99 73.66,89.13 LASER_HEADER.9
  Bottom 0.254: LASR_SW.D 69.85,113.03 LASER_HEADER.1
N$52
  Top 2.54: PCBPOWER.2 61.54,23.32 PCB_SW.1
N$63
  Top 0.254: R56.2 C5.1 28.76,115.57 R12.2 28.64,111.46 28.55,111.38 28.55,106.04 31.16,103.42 31.16,102.64 32.73,101.08 33.19,101.08 33.77,100.5 33.77,99.06 IC5.14
N$65
  Top 0.254: R38.1 34.29,103.44 IC5.13
N$66
  Top 0.254: IC5.94 45.25,94.44 46.4,93.29 46.4,82.27 | JP1.2 38.99,76.41 43.86,81.28 45.42,81.28 45.57,81.43 | 45.57,81.43 46.4,82.27 | 46.4,82.27 45.57,81.43
N$67
  Top 0.254: JP1.1 41.4,69.09 R35.2
N$68
  Top 0.254: R38.2 32.32,106.36 Q11.2 29.53,109.15 C39.1
N$69  (via drill 0.35)
  Top 0.254: JP1.3 R36.1 | v33.02,63.5 v33.02,68.96
  Bottom 0.254: BOOT0.D v33.02,63.5 | v33.02,68.96 JP1.3
N$70
  Top 0.254: IC5.12 34.81,99.06 34.81,99.98 36.58,101.74 Q11.1 37.78,108.39 C40.1
N$73
  Bottom 0.254: RM_SW.D 67,127 68.12,128.12 69.04,128.12 70.16,127 RIGHT_MOTOR.4
N$83
  Top 0.254: JP3.3 R13.2
NRST  (via drill 0.35)
  Top 0.254: RST.C 18.32,121.38 NRST.D | v13.97,87.63 13.84,87.76 v13.84,121.41
  Bottom 0.254: NRST.D v13.84,121.41 | STLINK.5 v13.97,87.63
PCB_CELL1  (via drill 0.35)
  Top 0.254: R22.1 PCB1.TP v58.42,58.16 | v25.4,69.85 25.4,82.22 26.08,82.9 26.08,83.42 27.96,85.3 29.81,85.3 30.21,85.7 30.21,86.26 29.81,86.66 28.72,86.66 27.82,87.56 27.82,95.23 27.63,95.42 26.71,95.42 IC5.30
  Bottom 0.254: v25.4,69.85 35.22,69.85 36.03,70.66 42.05,70.66 52.36,60.35 55.5,60.35 55.69,60.16 55.69,57.02 R21.2 C8.1 v58.42,58.16
PCB_CELL2  (via drill 0.35)
  Top 0.254: R20.1 PCB2.TP v54.61,58.16 | v18.95,64.77 18.95,87.2 19.18,87.43 19.18,92.06 22.04,94.92 26.67,94.92 IC5.31
  Bottom 0.254: v18.95,64.77 47.27,64.77 51.88,60.16 51.88,57.01 53.56,55.32 53.58,55.32 R19.2 C7.1 v54.61,58.16
PCB_CELL3  (via drill 0.35)
  Top 0.254: R18.1 PCB3.TP v50.8,58.16 | IC5.32 26.67,94.42 22.18,94.42 19.64,91.87 v19.64,62.23
  Bottom 0.254: v19.64,62.23 42.86,62.23 R17.2 C6.1 v50.8,58.16
R_MOS  (via drill 0.35)
  Top 0.254: R53.2 v49.53,81.28 | IC5.68 36.77,83.82 36.77,82.76 36.16,82.14 v36.16,81.25
  Bottom 0.254: R53.2 51.92,129.54 RM_SW.G | v36.16,81.25 49.51,81.25 v49.53,81.28
  other vias: 49.53,127.15
R_PWM  (via drill 0.35)
  Top 0.254: IC5.64 v34.79,77.61 v34.8,77.6 | v71.12,134.62 71.12,120.43 71.13,120.42 71.13,82.2 70.79,81.86 70.79,79.43 71.15,79.07 71.15,77.5 v71.17,77.52
  Bottom 0.254: RIGHT_MOTOR.1 v71.12,134.62 | v71.17,77.52 34.88,77.52 v34.8,77.6
RASPI_MOS  (via drill 0.35)
  Top 0.254: v37.59,33.02 37.59,39.83 37.17,40.26 37.17,55.87 37.6,56.3 37.6,79.31 37.89,79.6 37.89,80.17 37.79,80.27 IC5.70
  Bottom 0.254: R16.2 53.02,17.53 53.02,19.14 52.07,20.09 52.07,26.9 48.7,30.27 40.34,30.27 v37.59,33.02
  Bottom 0.508: R16.2 51.94,12.7 RASPI_SW.G
SWCLK  (via drill 0.35)
  Top 0.254: v10,95.25 v10,81.97 | IC5.76 43.47,85.44 44.07,84.84 v44.07,81.96
  Bottom 0.254: STLINK.2 v10,95.25 | v10,81.97 13.58,81.97 13.69,81.87 23.14,81.87 23.25,81.97 30.09,81.97 31.47,80.6 31.75,80.6 32.03,80.6 33.4,81.97 40.64,81.97 41.53,81.97 41.53,81.96 43.18,81.96 v44.07,81.96
SWDIO  (via drill 0.35)
  Top 0.254: v38.28,73.79 38.28,79.34 39.18,80.24 39.18,80.84 38.79,81.23 IC5.72 | v10.68,88.9 12.7,86.88 v12.7,73.79
  Bottom 0.254: v12.7,73.79 35.56,73.79 v38.28,73.79 | STLINK.4 9.41,90.17 v10.68,88.9
SWO  (via drill 0.35)
  Top 0.254: v29.34,87.76 38.98,87.76 40.76,89.54 40.76,91.73 40.95,91.92 41.87,91.92 IC5.89
  Bottom 0.254: v29.34,87.76 29.31,87.78 15.27,87.78 12.57,85.09 STLINK.6
VBAT  (via drill 0.35)
  Top 0.508: R43.1 58.67,8.89 CONV_SW_REG.1 57.19,16.21 57.19,24.71 60.2,27.72 PCB_SW.2 | RASPI_SW_REG.1 49.4,22.99 R44.1 | MICRO_SW_REG.1 33.02,21.59 7.62,21.59 LTE_SW_REG.1
  Top 1.778: PCB_SW.2 55.19,24.13 RASPI_SW_REG.1 47.61,24.13 47.59,24.16 46.99,24.16 46.39,24.16 46.37,24.13 MICRO_SW_REG.1
  Bottom 0.508: R44.1 R16.1
  other vias: 49.4,18.35
VCC  (via drill 0.35)
  Top 0.254: IC5.50 25.75,85.44 25.4,85.09 v25.4,83.19 | IC5.75 40.29,85.38 C44.1 | C26.1 v29.46,91.44 | v21.59,109.22 21.59,112.14 JP2.1 21.72,114.62 R52.1 26.67,115.51 R12.1 | R54.2 72.39,73.81 JP5.2 | IC5.19 31.29,96.22 31.82,95.69 C41.1 | IC5.100 43.15,97.44 C45.1 | IC5.28 26.67,96.42 25.75,96.42 25.46,96.12 v24.77,96.12 | R47.2 40.96,98.29 40.58,97.91 40.06,97.91 C38.2 37.79,95.75 IC5.6 | SPI_CMP.8 8.37,104.66 8.96,104.08 v8.96,102.81 | IC5.11 35.29,95.71 C25.1 | C13.2 7.37,109.22 SPI_CMP.15
  Top 0.508: MICRO_REG.2 19.84,30.16 C18.1 16.75,30.16 C4.+ | v1.39,34.29 v1.39,82.55 v1.39,97.79 v1.39,100.33 v1.39,109.22 1.39,122.04 COMPASS_HEADER.1 | v76.2,35.56 v76.2,76.2 v76.2,119.38 | v31.75,36.83 v31.75,53.34 31.75,71.12 v31.75,74.68 v31.75,81.28 | R49.2 R47.2 43.94,99.89 C45.1
  Bottom 0.254: v25.4,83.19 C43.1 28.55,84.49 28.55,86.87 28.74,87.06 30.86,87.06 C26.1 | C26.1 v38.02,91.44 39.05,90.41 39.05,86.65 40.13,85.57 C44.1 | STLINK.1 v1.39,97.79 | JP4.1 v31.75,53.34 | R36.2 31.81,74.74 v31.75,74.68 | R54.2 v76.2,76.2 | COMPASS_HEADER.1 COMPASS_HEADER.2 | v24.77,96.12 C42.1 27.15,93.56 27.15,92.48 28.19,91.44 v29.46,91.44 | C41.1 32.64,95.66 33.72,94.58 33.72,93.98 34.23,93.47 34.23,93 34.42,92.81 34.89,92.81 35.24,92.46 C26.1 | v1.39,100.33 2.7,101.64 7.16,101.64 8.39,102.87 C14.1 | C26.1 35.24,91.86 36.39,93 36.39,94.61 C25.1 | v1.39,82.55 9.5,82.55 10.77,83.82 15.2,83.82 R14.1 | C13.2 8.89,109.22
  Bottom 0.508: C4.+ 14.21,29.92 R48.1 | C14.1 v8.96,102.81 | C4.+ 12.14,34.29 v1.39,34.29 | C4.+ 16.79,30.2 | 16.79,30.2 22.15,35.56 v76.2,35.56 | v76.2,119.38 R55.2 | v31.75,36.83 20.32,36.83 16.51,33.02 16.51,30.48 16.79,30.2 | C26.1 35.24,87.77 34.27,86.79 34.27,83.8 v31.75,81.28 | R49.2 38.78,105.77 31.11,105.77 30.45,106.43 L1.2 24.77,109.22 v21.59,109.22 8.89,109.22 v1.39,109.22
  other vias: 16.51,29.92 13.97,30.16 35.31,95.69 32.64,95.69 40.13,85.54 35.24,91.44 37.85,95.69 70,119.38 27.56,106.43 36.45,74.74 70,76.2 40.96,107.95 43.94,98.23 40.96,102.87 8.89,110.74
VDD  (via drill 0.35)
  Top 0.254: LASER_HEADER.10 73.66,86.59 71.81,88.45 71.81,89.35 73.66,91.21 LASER_HEADER.8 73.66,91.67 71.81,93.53 71.81,94.43 73.66,96.29 LASER_HEADER.6 73.66,96.75 71.81,98.61 71.81,99.51 73.66,101.37 LASER_HEADER.4 73.66,101.83 71.81,103.69 71.81,104.59 73.66,106.45 LASER_HEADER.2 | LDR_HEADER.9 66.04,89.13 67.89,90.99 67.89,91.89 66.04,93.75 LDR_HEADER.7 66.04,94.21 67.89,96.07 67.89,96.97 66.04,98.83 LDR_HEADER.5 66.04,99.29 67.89,101.15 67.89,102.05 66.04,103.91 LDR_HEADER.3 66.04,104.37 67.89,106.23 67.89,106.68 67.89,107.13 67.25,107.77 66.8,107.77 66.04,108.53 LDR_HEADER.1
  Top 0.508: v26.67,22.86 19.75,22.86 C10.1 22.12,23.18 MICRO_REG.3 | MICRO_SW_REG.3 v35.56,34.29 | v77.34,34.29 v77.34,86.36
  Bottom 0.254: LDR_HEADER.1 68.58,106.68 LASER_HEADER.2
  Bottom 0.508: C3.+ v26.67,22.86 29.21,22.86 MICRO_SW_REG.3 | v35.56,34.29 v77.34,34.29 | v77.34,34.29 | v77.34,86.36 LASER_HEADER.10 | LASER_HEADER.10
VDD_BREAKOUT  (via drill 0.35)
  Top 0.254: CMP_BRKOUT.2 CMP_BRKOUT.1 10.16,177.8 v10.16,167.64 | R9.1 26.8,171.22 26.8,173.73 C12.1 25.53,172.72 22.86,172.72 22.34,173.24 IC3.8 | IC3.12 23.61,176.01 v24.13,176.53 | IC3.2 20.07,175.53 19.08,175.53 18.37,176.25 18.37,177.59 v18.03,177.93 | v20.32,177.8 20.63,177.49 21.13,177.49 21.32,177.3 21.32,176.78 IC3.15 | IC3.11 23.11,175.49 23.63,175.49 23.86,175.26 v24.13,175.26
  Bottom 0.254: C11.1 CMP_BRKOUT.2 | v20.32,177.8 19.05,179.07 CMP_BRKOUT.2 | CMP_BRKOUT.2 12.55,177.95 R10.1 16.54,177.93 v18.03,177.93 | v24.13,175.26 21.29,175.26 20.02,176.53 | R9.1 23.52,167.64 v10.16,167.64 | CMP_BRKOUT.2 13.29,177.21 19.33,177.21 20.02,176.53 | v24.13,176.53 20.02,176.53
  other vias: 25.53,179.07 26.95,171.07

## Text on the board
tDocu: ECE477 Group 6 / Qianli Ma / Shuang Liu / Tianjie Jia / Peiyuan Shen / Version 1 / Modified 10.18.2018